# Altium project Quail_3.1.PrjPcb (part 3 of 3)

## Sheet LoadCell.SchDoc
size A
Used 2 times, as channels AFE/LC1, AFE/LC2. Parts and nets are listed once, with the designators drawn on the sheet.
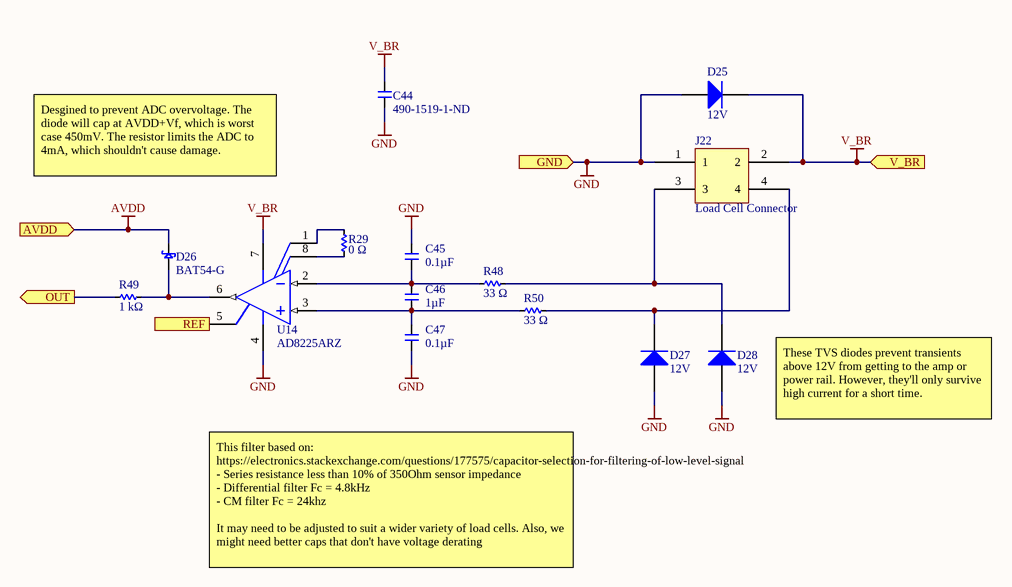
[diagram p9: LoadCell.SchDoc]

### Parts
C44  490-1519-1-ND  [C0603]
C45  Capacitance: 0.1µF  [C0603]  (hidden comment: CAP_CER_100NF_100V)
C46  Capacitance (shorthand): 1µF  [C0603]  (hidden comment: 490-3900-1-ND)
C47  Capacitance: 0.1µF  [C0603]  (hidden comment: CAP_CER_100NF_100V)
D25  Reverse Standoff Voltage: 12V  [VISH-DO-214AC-2_M]  (hidden comment: SMAJ12A-E3/61)
D26  Manufacturer Part Number: BAT54-G  [3SOT23]  (hidden comment: SCHOTTKY_BAT54-G)
D27  Reverse Standoff Voltage: 12V  [VISH-DO-214AC-2_M]  (hidden comment: SMAJ12A-E3/61)
D28  Reverse Standoff Voltage: 12V  [VISH-DO-214AC-2_M]  (hidden comment: SMAJ12A-E3/61)
J22  Load Cell Connector  [MOLEX_2x2_0430450400]
R29  Resistance: 0 Ω  [R0603]  (hidden comment: 311-0.0HRCT-ND)
R48  Resistance: 33 Ω  [R0603]  (hidden comment: 311-33.0HRCT-ND)
R49  Resistance: 1 kΩ  [R0603]  (hidden comment: 311-1.00KHRCT-ND)
R50  Resistance: 33 Ω  [R0603]  (hidden comment: 311-33.0HRCT-ND)
U14  AD8225ARZ  [ADI-R-8_N]

### Ports
AVDD (in), GND (in), OUT (out), REF (in), V_BR (in)

### Nets
AVDD: D26.3 ; port AVDD
GND: C44.2 C45.1 C47.2 D25.2(A) D27.2(A) D28.2(A) J22.1 U14.4(VS-) ; port GND
V_BR: C44.1 D25.1(K) J22.2 U14.7(VS+) ; port V_BR
OUT: R49.1 ; port OUT
REF: U14.5(REF) ; port REF
NetC45_2: C45.2 C46.1 R48.1 U14.2(IN-)
NetC46_2: C46.2 C47.1 R50.1 U14.3(IN+)
NetD26_1: D26.1 R49.2 U14.6(VOUT)
NetD27_1: D27.1(K) J22.4 R50.2
NetD28_1: D28.1(K) J22.3 R48.2
NetR29_1: R29.1 U14.8(NC)
NetR29_2: R29.2 U14.1(NC)

### Channels
AFE/LC1: designators end in A; ports AVDD=AVDD GND=AGND OUT=AIN12 REF=REF-1V65 V_BR=VBR
AFE/LC2: designators end in B; ports AVDD=AVDD GND=AGND OUT=AIN13 REF=REF-1V65 V_BR=VBR

### Notes on the sheet
- Desgined to prevent ADC overvoltage. The diode will cap at AVDD+Vf, which is worst case 450mV. The resistor limits the ADC to 4mA, which shouldn't cause damage.
- These TVS diodes prevent transients above 12V from getting to the amp or power rail. However, they'll only survive high current for a short time.
- This filter based on:
  https://electronics.stackexchange.com/questions/177575/capacitor-selection-for-filtering-of-low-level-signal
  - Series resistance less than 10% of 350Ohm sensor impedance
  - Differential filter Fc = 4.8kHz
  - CM filter Fc = 24khz
  It may need to be adjusted to suit a wider variety of load cells. Also, we might need better caps that don't have voltage derating

### Library data of the parts
C44 = CMP-119-0065-1: CAP CER 0603 0.1µF X7R 50V 10%; Manufacturer: Murata Electronics North America; Capacitance - pF (Machine readable): #NAME?; Capacitance (shorthand): 0.1µF; Rated Voltage: 50V; Dielectric: X7R
C45 C47 = CMP-027-0018-1: CAP CER 0.1UF 100V X7S 0603; Manufacturer: TDK Corporation; Manufacturer Part Number: C1608X7S2A104K080AB; Tolerance: ±10%; Failure Rate: -; Mounting Type: Surface Mount, MLCC; Pricing 1: 1=0.19, 10=0.133, 100=0.0673, 500=0.04604, 1000=0.04073 (USD); RoHS: RoHS Compliant; ComponentLink1Description: https://product.tdk.com/info/en/catalog/datasheets/mlcc_commercial_midvoltage_en.pdf; Features: -; Design Item ID: CAP_CER_100NF_100V; Lead Spacing: -; Source: capacitor.SchLib; Packaging: Cut Tape (CT); Lead Style: -; Ratings: -; Part Status: Active; Temperature Coefficient: X7S; Operating Temperature: -55°C ~ 125°C; ComponentLink1URL: https://product.tdk.com/info/en/catalog/datasheets/mlcc_commercial_midvoltage_en.pdf; Stock 1: 662530; Size / Dimension: 0.063" L x 0.031" W (1.60mm x 0.80mm); Voltage - Rated: 100V; Applications: General Purpose; Package / Case: 0603 (1608 Metric); Thickness (Max): 0.037" (0.95mm); Height - Seated (Max): -
C46 = CMP-119-0068-1: CAP CER 0603 1µF X7R 16V 10%; Manufacturer: Murata Electronics North America; Capacitance - pF (Machine readable): #NAME?; Rated Voltage: 16V; Dielectric: X7R
D25 D27 D28 = CMP-00008-1: VISHAY - SMAJ12A-E3/61 - TVS-diod, TVS, SMAJ1 Serien, Enkelriktad, 12 V, 19.9 V, DO-214AC (SMA), 2 Stift; Current: 201A; Test Current: 1mA; Clamping Voltage: 19.9V; Min Breakdown Voltage: 13.3V; Direction: Unidirectional; Peak Pulse Power: 400W; Max Breakdown Voltage: 14.7V; Peak Pulse Current: 20.1A; Number of Channels: 1; Leakage Current: 1uA; Max Forward Surge Current (Ifsm): 40A; Element Configuration: Single; Number of Pins: 2; Min Operating Temperature: -55°C; Case/Package: SMA; Packaging: Tape and Reel; Radiation Hardening: No; Voltage Rating (DC): 12V; Height: 2.09mm; REACH SVHC: Unknown; Clamping Voltage-Max: 19.9V; Max Power Dissipation: 400W; Length: 4.5mm; Package Quantity: 1800; Operating Supply Voltage: 12V; Reverse Breakdown Voltage: 13.3V; Number of Elements: 1; Series: SMAJ; Lead Free: Lead Free; Termination: SMD/SMT; Voltage: 12V; Contact Plating: Tin,Matte; Width: 2.79mm; Power Dissipation: 400W; Polarity: Unidirectional; Max Reverse Leakage Current: 1uA; Max Surge Current: 20.1A; Max Operating Temperature: 150°C; Breakdown Voltage: 13.3V
D26 = CMP-033-0032-1: DIODE SCHOTTKY 200MA 30V SOT-23; Manufacturer: Comchip Technology; Capacitance @ Vr, F: 10pF @ 1V, 1MHz; Reverse Recovery Time (trr): 5ns; Current - Reverse Leakage @ Vr: 2mA @ 25V; Speed: Small Signal =< 200mA (Io), Any Speed; Voltage - Forward (Vf) (Max) @ If: 1V @ 100mA; Voltage - DC Reverse (Vr) (Max): 30V; Current - Average Rectified (Io): 200mA; Mounting Type: Surface Mount; ComponentLink1URL: http://comchipt.ipower.com/docs/BAT54.pdf; Diode Type: Schottky; Supplier Device Package: SOT-23-3; Stock 1: 5641; Source: diode.SchLib; Pricing 1: 1=0.35, 10=0.24, 100=0.112, 250=0.08, 500=0.0544, 1000=0.0432 (USD); RoHS: RoHS Compliant; Package / Case: TO-236-3, SC-59, SOT-23-3; ComponentLink1Description: Datasheet; Packaging: Cut Tape (CT); Design Item ID: SCHOTTKY_BAT54-G
J22 = CMP-030-0039-1: MICROFIT CONN HEADER R/A 4POS 3MM; Design Item ID: MOLEX_2x2_0430450400; Source: connector.SchLib
R29 = CMP-126-0000-2: RES SMD 0 OHM JUMPER 1/10W 0603; Manufacturer: Yageo; Manufacturer Part Number: RC0603FR-070RL; Power (Watts): 0.1W, 1/10W; Resistance (Sortable): 0; Temperature Coefficient: -; Datasheets: http://www.yageo.com/documents/recent/PYu-RC_Group_51_RoHS_L_9.pdf; Tolerance: Jumper; Image: //media.digikey.com/Renders/Yageo%20Renders/0603-(1608-Metric).jpg; Operating Temperature: -55°C ~ 155°C; Supplier 1: Mouser; Supplier Part Number 1: 667-ERJ-PB3B2492V
R48 R50 = CMP-126-0025-2: RES SMD 33 OHM 1% 1/10W 0603; Manufacturer Part Number: RC0603FR-0733RL; Manufacturer: Yageo; Power (Watts): 0.1W, 1/10W; Temperature Coefficient: ±100ppm/°C; Resistance (Sortable): 33; Tolerance: ±1%; Operating Temperature: -55°C ~ 155°C; Datasheets: http://www.yageo.com/documents/recent/PYu-RC_Group_51_RoHS_L_9.pdf; Image: //media.digikey.com/Renders/Yageo%20Renders/0603-(1608-Metric).jpg
R49 = CMP-126-0172-2: RES SMD 1K OHM 1% 1/10W 0603; Manufacturer Part Number: RC0603FR-071KL; Manufacturer: Yageo; Power (Watts): 0.1W, 1/10W; Temperature Coefficient: ±100ppm/°C; Resistance (Sortable): 1000; Tolerance: ±1%; Operating Temperature: -55°C ~ 155°C; Datasheets: http://www.yageo.com/documents/recent/PYu-RC_Group_51_RoHS_L_9.pdf; Image: //media.digikey.com/Renders/Yageo%20Renders/0603-(1608-Metric).jpg
U14 = CMP-00004-1: SP Amp INSTR Amp Single ±18V/36V 8-Pin SOIC N Tube; Max Power Dissipation: 650mW; Number of Elements: 1; Max Dual Supply Voltage: 18V; Input Offset Voltage (Vos): 50uV; Min Dual Supply Voltage: 1.7V; Common Mode Rejection Ratio: 86dB; Min Supply Voltage: 3.4V; Output Current per Channel: 18mA; Bandwidth: 900kHz; Nominal Supply Current: 1.05mA; Power Supply Rejection Ratio (PSRR): 90dB; Voltage Gain: 13.98dB; Max Supply Voltage: 36V; Operating Supply Current: 1.2mA; Slew Rate: 5V/µs; Input Bias Current: 1.2nA; Input Resistance: 10GR; Length: 5mm; Radiation Hardening: No; Number of Amplifiers: 1; Package Quantity: 98; Power Dissipation: 650mW; Lead Free: Contains Lead; Number of Circuits: 1; Min Operating Temperature: -40°C; Number of Pins: 8; Quiescent Current: 1.05mA; Contact Plating: Tin,Matte; -3db Bandwidth: 900kHz; REACH SVHC: No SVHC; Width: 4mm; Height: 1.5mm; Max Operating Temperature: 85°C; Packaging: Rail/Tube; Number of Channels: 1; Case/Package: SOIC; Max Supply Current: 1.2mA

## Sheet PressureTransducer.SchDoc
size A
Used 4 times, as channels AFE/PT1, AFE/PT2, AFE/PT3, AFE/PT4. Parts and nets are listed once, with the designators drawn on the sheet.
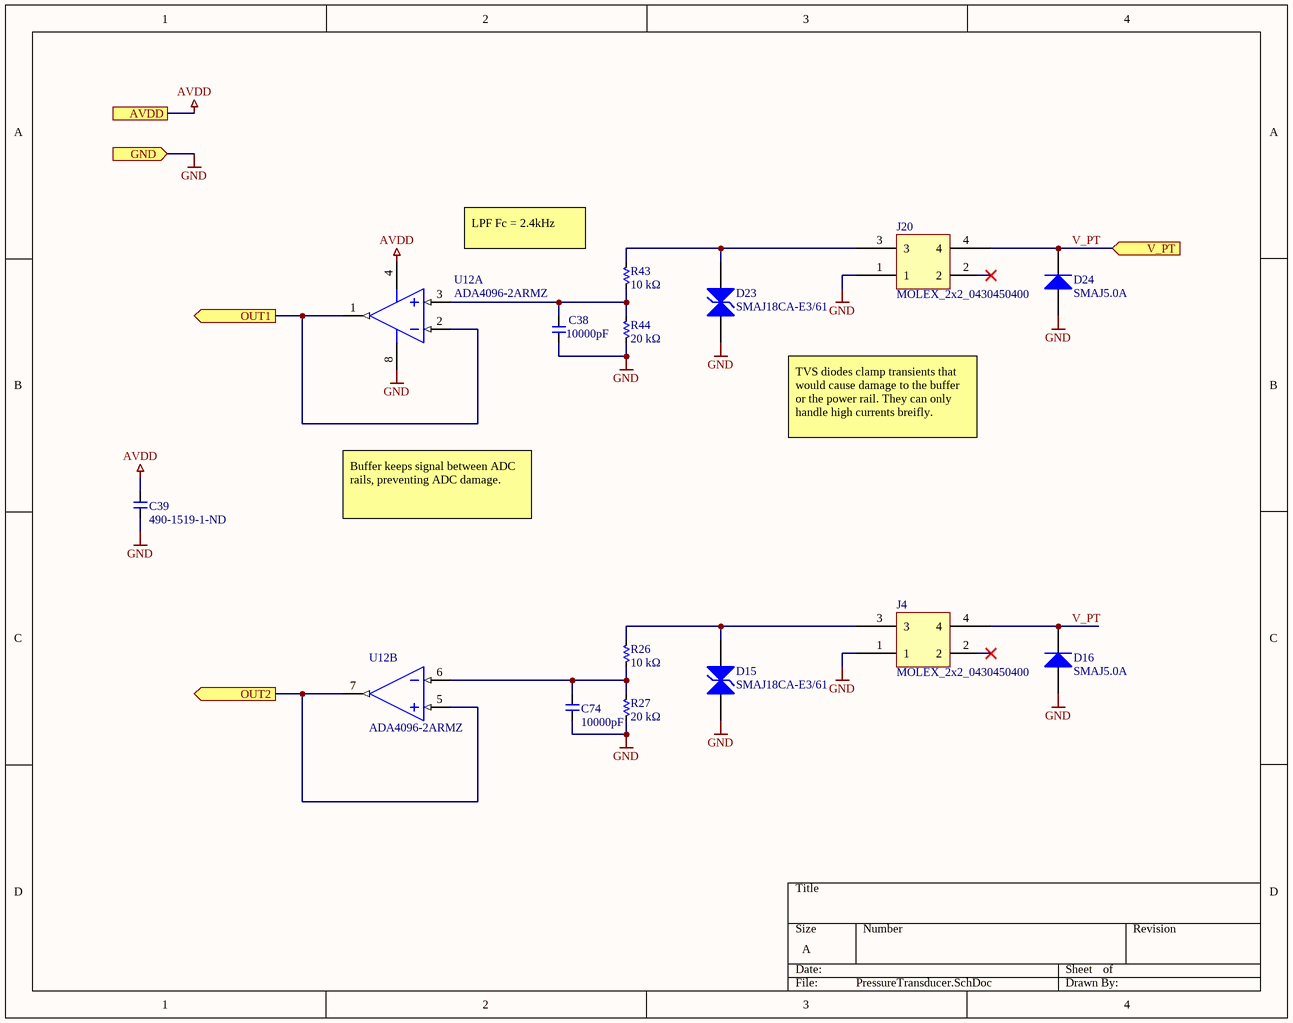
[diagram p10: PressureTransducer.SchDoc]

### Parts
C38  Capacitance (shorthand): 10000pF  [C0603]  (hidden comment: 490-1512-1-ND)
C39  490-1519-1-ND  [C0603]
C74  Capacitance (shorthand): 10000pF  [C0603]  (hidden comment: 490-1512-1-ND)
D15  SMAJ18CA-E3/61  [VISH-DO-214AC-2_M]
D16  SMAJ5.0A  [BOUR-SMA-2_V]
D23  SMAJ18CA-E3/61  [VISH-DO-214AC-2_M]
D24  SMAJ5.0A  [BOUR-SMA-2_V]
J4  MOLEX_2x2_0430450400  [MOLEX_2x2_0430450400]
J20  MOLEX_2x2_0430450400  [MOLEX_2x2_0430450400]
R26  Resistance: 10 kΩ  [R0603]  (hidden comment: 311-10.0KHRCT-ND)
R27  Resistance: 20 kΩ  [R0603]  (hidden comment: 311-20.0KHRCT-ND)
R43  Resistance: 10 kΩ  [R0603]  (hidden comment: 311-10.0KHRCT-ND)
R44  Resistance: 20 kΩ  [R0603]  (hidden comment: 311-20.0KHRCT-ND)
U12  ADA4096-2ARMZ  [ADI-RM-8_M]  (parts A,B of 2)

### Ports
AVDD, GND (in), OUT1 (out), OUT2 (out), V_PT (in)

### Nets
AVDD: C39.1 U12.4(-V) ; port AVDD
GND: C38.2 C39.2 C74.2 D15.1(A1) D16.1(A) D23.1(A1) D24.1(A) J4.1 J20.1 R27.1 R44.1 U12.8(+V) ; port GND
OUT1: U12.1(OUT_A) U12.2(-IN_A) ; port OUT1
OUT2: U12.5(+IN_B) U12.7(OUT_B) ; port OUT2
V_PT: D16.2(K) D24.2(K) J4.4 J20.4 ; port V_PT
NetC38_1: C38.1 R43.1 R44.2 U12.3(+IN_A)
NetC74_1: C74.1 R26.1 R27.2 U12.6(-IN_B)
NetD15_2: D15.2(A2) J4.3 R26.2
NetD23_2: D23.2(A2) J20.3 R43.2

Not connected (* = marked no-connect by the designer): J4 2*; J20 2*

### Channels
AFE/PT1: designators end in A; ports AVDD=AVDD GND=AGND OUT1=AIN1 OUT2=AIN2 V_PT=V_PT
AFE/PT2: designators end in B; ports AVDD=AVDD GND=AGND OUT1=AIN3 OUT2=AIN4 V_PT=V_PT
AFE/PT3: designators end in C; ports AVDD=AVDD GND=AGND OUT1=AIN5 OUT2=AIN6 V_PT=V_PT
AFE/PT4: designators end in D; ports AVDD=AVDD GND=AGND OUT1=AIN7 OUT2=AIN8 V_PT=V_PT

### Notes on the sheet
- LPF Fc = 2.4kHz
- TVS diodes clamp transients that would cause damage to the buffer or the power rail. They can only handle high currents breifly.
- Buffer keeps signal between ADC rails, preventing ADC damage.

### Library data of the parts
C38 C74 = CMP-119-0053-1: CAP CER 0603 10000pF X7R 50V 10%; Manufacturer: Murata Electronics North America; Capacitance - pF (Machine readable): #NAME?; Dielectric: X7R; Rated Voltage: 50V
C39 = CMP-119-0065-1: as C44 on sheet LoadCell; Capacitance (shorthand): 0.1µF; Dielectric: X7R; Rated Voltage: 50V
D15 D23 = CMP-00018-1: Diode TVS Single Bi-Dir 18V 400W 2-Pin SMA T/R; Number of Channels: 1; Max Breakdown Voltage: 22.1V; Direction: Bidirectional; Max Reverse Leakage Current: 1uA; Clamping Voltage: 29.2V; Max Surge Current: 13.7A; Max Forward Surge Current (Ifsm): 40A; Test Current: 1mA; Min Breakdown Voltage: 20V; Power Dissipation: 400W; Lead Free: Lead Free; Max Operating Temperature: 150°C; Weight: 0.064g; Min Operating Temperature: -55°C; Operating Supply Voltage: 18V; Case/Package: DO-214AC; Polarity: Bidirectional; Termination: SMD/SMT; Height: 0.09inch; Width: 0.11inch; Series: SMAJ; Reverse Standoff Voltage: 18V; Clamping Voltage-Max: 29.2V; Max Power Dissipation: 400W; Package Quantity: 1800; Voltage Rating (DC): 18V; REACH SVHC: Unknown; Packaging: Tape and Reel; Radiation Hardening: No; Peak Pulse Current: 13.7A; Length: 0.177inch; Element Configuration: Single; Number of Elements: 1; Leakage Current: 1uA; Peak Pulse Power: 400W; Number of Pins: 2; Reverse Breakdown Voltage: 20V; Contact Plating: Tin,Matte; Breakdown Voltage: 20V
D16 D24 = CMP-00017-1: BOURNS - SMAJ5.0A - TVS Diode, SMAJ Series, Unidirectional, 5 V, 9.2 V, DO-214AC (SMA), 2 Pins; Min Breakdown Voltage: 6.4V; ESD Protection: Yes; Test Current: 10mA; Clamping Voltage: 9.2V; Leakage Current: 800uA; Max Breakdown Voltage: 7V; Number of Unidirectional Channels: 1; Operating Supply Voltage: 3.5V; Peak Pulse Current: 43.5A; Power Line Protection: No; Peak Pulse Power: 400W; Reverse Standoff Voltage: 5V; Diode Type: ZENER; Element Configuration: Single; Max Surge Current: 40A; Height: 2.42mm; Case/Package: DO-214AC; Max Reverse Leakage Current: 800uA; Packaging: Tape and Reel; REACH SVHC: No SVHC; Direction: Unidirectional; Series: SMAJ; Radiation Hardening: No; Mount: Surface Mount; Max Operating Temperature: 150°C; Package Quantity: 1; Width: 2.92mm; Reverse Breakdown Voltage: 6.4V; Number of Channels: 1; Polarity: Unidirectional; Min Operating Temperature: -55°C; Length: 4.57mm; Resistor Type: Zener; Max Power Dissipation: 400W; Number of Pins: 2; Breakdown Voltage: 7V; Number of Elements: 1; Termination: SMD/SMT
J4 J20 = CMP-030-0039-1: MICROFIT CONN HEADER R/A 4POS 3MM; Design Item ID: MOLEX_2x2_0430450400; Source: connector.SchLib
R26 R43 = CMP-126-0273-2: RES SMD 10K OHM 1% 1/10W 0603; Manufacturer Part Number: RC0603FR-0710KL; Manufacturer: Yageo; Resistance (Sortable): 10000; Power (Watts): 0.1W, 1/10W; Temperature Coefficient: ±100ppm/°C; Datasheets: http://www.yageo.com/documents/recent/PYu-RC_Group_51_RoHS_L_9.pdf; Image: //media.digikey.com/Renders/Yageo%20Renders/0603-(1608-Metric).jpg; Tolerance: ±1%; Operating Temperature: -55°C ~ 155°C
R27 R44 = CMP-126-0304-2: RES SMD 20K OHM 1% 1/10W 0603; Manufacturer Part Number: RC0603FR-0720KL; Manufacturer: Yageo; Resistance (Sortable): 20000; Power (Watts): 0.1W, 1/10W; Temperature Coefficient: ±100ppm/°C; Datasheets: http://www.yageo.com/documents/recent/PYu-RC_Group_51_RoHS_L_9.pdf; Image: //media.digikey.com/Renders/Yageo%20Renders/0603-(1608-Metric).jpg; Tolerance: ±1%; Operating Temperature: -55°C ~ 155°C
U12 = CMP-00007-2: Operational Amplifier, Dual, 501 kHz, 2, 0.25 V/ s, 3V to 30V, MSOP, 8 ;RoHS Compliant: Yes; Number of Circuits: 2; Common Mode Rejection Ratio: 77dB; Bandwidth: 501kHz; Amplifier Type: GENERAL PURPOSE; Max Dual Supply Voltage: 15V; Input Capacitance: 7pF; Operating Supply Current: 120uA; -3db Bandwidth: 152kHz; Power Supply Rejection Ratio (PSRR): 100dB; Quiescent Current: 60uA; Gain Bandwidth Product: 786kHz; Unity Gain Bandwidth Product: 550kHz; Input Bias Current: 10nA; Voltage Gain: 111dB; Input Voltage Noise Density: 27nV/sqrt Hz; Min Dual Supply Voltage: 1.5V; Input Offset Voltage (Vos): 300uV; Slew Rate: 0.25V/µs; Output Current per Channel: 10mA; Number of Channels: 2; Case/Package: MSOP; Min Supply Voltage: 3V; Number of Amplifiers: 2; Width: 3.2mm; Packaging: Rail/Tube; Length: 3.2mm; Series: -; Max Operating Temperature: 125°C; Technology: BIPOLAR; REACH SVHC: No SVHC; Height: 0.95mm; Max Supply Voltage: 30V; Number of Pins: 8; Contact Plating: Tin,Matte; Radiation Hardening: No; Package Quantity: 50; Number of Elements: 2; Lead Free: Contains Lead; Min Operating Temperature: -40°C

## Sheet Thermocouple.SchDoc
size A
Used 3 times, as channels AFE/TC1, AFE/TC2, AFE/TC3. Parts and nets are listed once, with the designators drawn on the sheet.
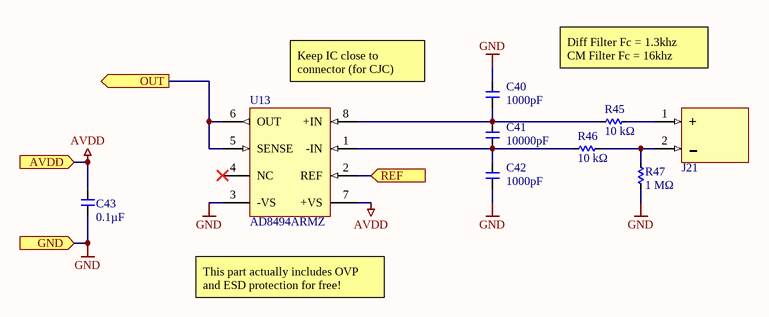
[diagram p11: Thermocouple.SchDoc]

### Parts
C40  Capacitance (shorthand): 1000pF  [C0603]  (hidden comment: 490-1494-1-ND)
C41  Capacitance (shorthand): 10000pF  [C0603]  (hidden comment: 490-1512-1-ND)
C42  Capacitance (shorthand): 1000pF  [C0603]  (hidden comment: 490-1494-1-ND)
C43  Capacitance (shorthand): 0.1µF  [C0603]  (hidden comment: 490-1519-1-ND)
J21  PCC-SMP-V-K  [PCC-SMP-V-K-Footprint-1]  (value not drawn)
R45  Resistance: 10 kΩ  [R0603]  (hidden comment: 311-10.0KHRCT-ND)
R46  Resistance: 10 kΩ  [R0603]  (hidden comment: 311-10.0KHRCT-ND)
R47  Resistance: 1 MΩ  [R0603]  (hidden comment: 311-1.00MHRCT-ND)
U13  AD8494ARMZ  [ADI-RM-8_N]

### Ports
AVDD (in), GND (in), OUT (out), REF (in)

### Nets
AVDD: C43.1 U13.7(+VS) ; port AVDD
GND: C40.1 C42.2 C43.2 R47.1 U13.3(-VS) ; port GND
OUT: U13.5(SENSE) U13.6(OUT) ; port OUT
REF: U13.2(REF) ; port REF
NetC40_2: C40.2 C41.1 R45.1 U13.8(+IN)
NetC41_2: C41.2 C42.1 R46.1 U13.1(-IN)
NetJ21_1: J21.1(+) R45.2
NetJ21_2: J21.2(-) R46.2 R47.2

Not connected (* = marked no-connect by the designer): U13 4(NC)*

### Channels
AFE/TC1: designators end in A; ports AVDD=AVDD GND=AGND OUT=NetR58_1 REF=REF-1V65
AFE/TC2: designators end in B; ports AVDD=AVDD GND=AGND OUT=NetR61_1 REF=REF-1V65
AFE/TC3: designators end in C; ports AVDD=AVDD GND=AGND OUT=NetR64_1 REF=REF-1V65

### Notes on the sheet
- (near U13) Keep IC close to connector (for CJC)
- Diff Filter Fc = 1.3khz
  CM Filter Fc = 16khz
- This part actually includes OVP and ESD protection for free!

### Library data of the parts
C40 C42 = CMP-119-0040-1: CAP CER 0603 1000pF X7R 50V 10%; Manufacturer: Murata Electronics North America; Capacitance - pF (Machine readable): #NAME?; Dielectric: X7R; Rated Voltage: 50V
C41 = CMP-119-0053-1: as C38 on sheet PressureTransducer; Rated Voltage: 50V; Dielectric: X7R
C43 = CMP-119-0065-1: as C44 on sheet LoadCell; Dielectric: X7R; Rated Voltage: 50V
J21 = CMP-00005-1: THERMOCOUPLE CONN, K TYPE, RCPT; Gender: Receptacle; Thermocouple Type: K; Product Range: PCC SMP Series; Junction Type: K
R45 R46 = CMP-126-0273-2: RES SMD 10K OHM 1% 1/10W 0603; Manufacturer Part Number: RC0603FR-0710KL; Manufacturer: Yageo; Power (Watts): 0.1W, 1/10W; Temperature Coefficient: ±100ppm/°C; Resistance (Sortable): 10000; Tolerance: ±1%; Operating Temperature: -55°C ~ 155°C; Datasheets: http://www.yageo.com/documents/recent/PYu-RC_Group_51_RoHS_L_9.pdf; Image: //media.digikey.com/Renders/Yageo%20Renders/0603-(1608-Metric).jpg
R47 = CMP-126-0484-2: RES SMD 1M OHM 1% 1/10W 0603; Manufacturer Part Number: RC0603FR-071ML; Manufacturer: Yageo; Power (Watts): 0.1W, 1/10W; Resistance (Sortable): 1000000; Temperature Coefficient: ±100ppm/°C; Operating Temperature: -55°C ~ 155°C; Image: //media.digikey.com/Renders/Yageo%20Renders/0603-(1608-Metric).jpg; Datasheets: http://www.yageo.com/documents/recent/PYu-RC_Group_51_RoHS_L_9.pdf; Tolerance: ±1%
U13 = CMP-00003-2: IC THRMOCPLE COLD JNC COMP 8MSOP; Nominal Supply Current: 180uA; Max Supply Current: 250uA; Output Type: Analog; Gain Bandwidth Product: 30kHz; Max Supply Voltage: 18V; Min Supply Voltage: 2.7V; Length: 3.2mm; Height: 0.95mm; Contact Plating: Tin,Matte; Package Quantity: 50; REACH SVHC: No SVHC; Operating Supply Current: 180uA; Max Operating Temperature: 125°C; Case/Package: MSOP; Min Operating Temperature: -40°C; Packaging: Rail/Tube; Number of Pins: 8; Lead Free: Contains Lead; Dual Supply Voltage: 18V; Width: 3.2mm

## Sheet Ethernet.SchDoc
size A3
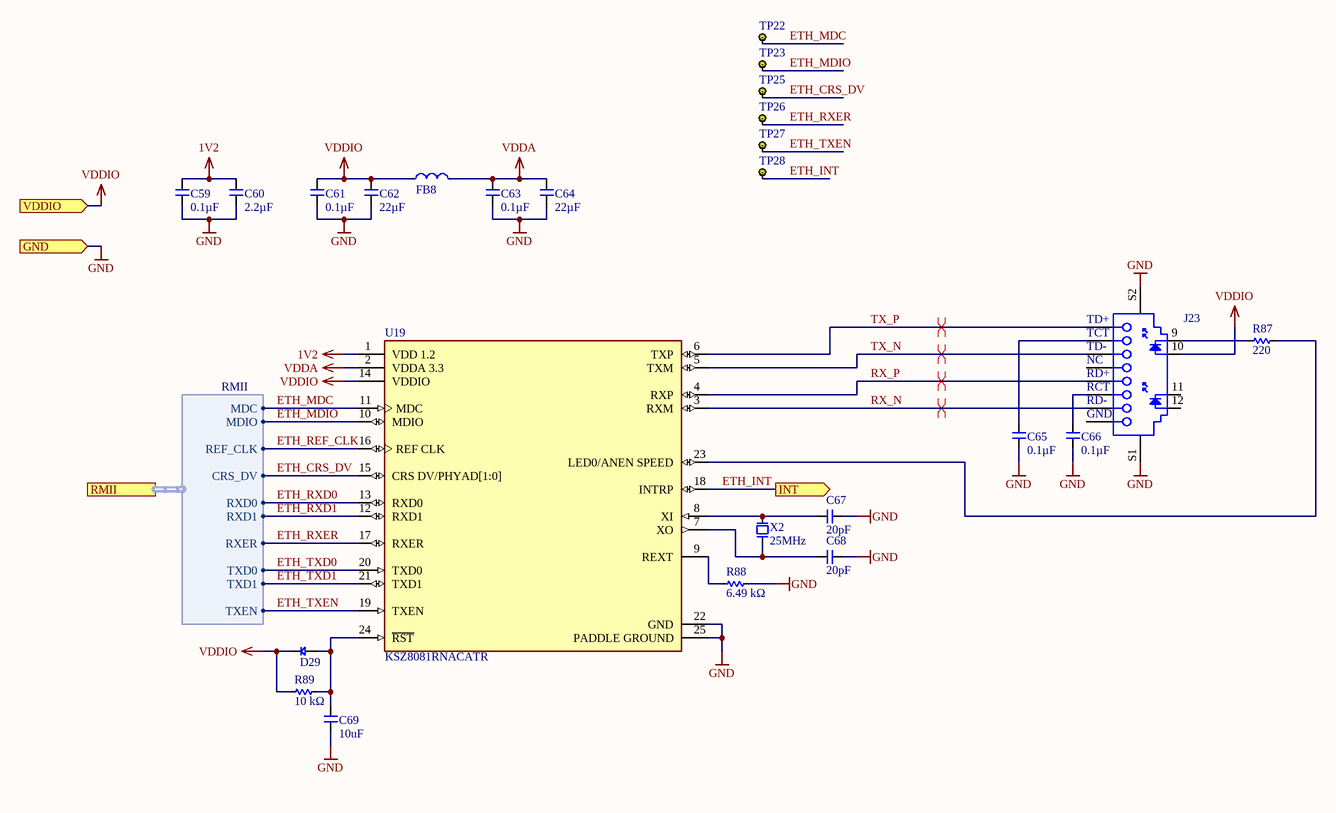
[diagram p12: Ethernet.SchDoc]

### Parts
C59  Capacitance (shorthand): 0.1µF  [C0603]  (hidden comment: 490-1519-1-ND)
C60  Capacitance (shorthand): 2.2µF  [C0603]  (hidden comment: 490-10731-1-ND)
C61  Capacitance (shorthand): 0.1µF  [C0603]  (hidden comment: 490-1519-1-ND)
C62  Capacitance (shorthand): 22µF  [C0603]  (hidden comment: 1276-7076-1-ND)
C63  Capacitance (shorthand): 0.1µF  [C0603]  (hidden comment: 490-1519-1-ND)
C64  Capacitance (shorthand): 22µF  [C0603]  (hidden comment: 1276-7076-1-ND)
C65  Capacitance (shorthand): 0.1µF  [C0603]  (hidden comment: 490-1519-1-ND)
C66  Capacitance (shorthand): 0.1µF  [C0603]  (hidden comment: 490-1519-1-ND)
C67  Capacitance (shorthand): 20pF  [C0603]  (hidden comment: 490-1410-1-ND)
C68  Capacitance (shorthand): 20pF  [C0603]  (hidden comment: 490-1410-1-ND)
C69  Capacitance: 10uF  [C0603]  (hidden comment: CAP_CER_10UF_6.3V_20%_X5R_SMD)
D29  DIODE_1N4148WT  [SOD523]  (value not drawn)
FB8  FB_120@100MHz_0603  [C0603]  (value not drawn)
J23  SI-50170-F  [BELS-SI-50170-F_V]  (value not drawn)
R87  Resistance (Sortable): 220  [R0603]  (hidden comment: 311-220HRCT-ND)
R88  Resistance: 6.49 kΩ  [R0603]  (hidden comment: 311-6.49KHRCT-ND)
R89  Resistance: 10 kΩ  [R0603]  (hidden comment: 311-10.0KHRCT-ND)
TP22  TEST_POINT_BLACK_KEYSTONE_5001  [TEST_POINT_BLACK_KEYSTONE_5001-Footprint-1]  (value not drawn)
TP23  TEST_POINT_BLACK_KEYSTONE_5001  [TEST_POINT_BLACK_KEYSTONE_5001-Footprint-1]  (value not drawn)
TP25  TEST_POINT_BLACK_KEYSTONE_5001  [TEST_POINT_BLACK_KEYSTONE_5001-Footprint-1]  (value not drawn)
TP26  TEST_POINT_BLACK_KEYSTONE_5001  [TEST_POINT_BLACK_KEYSTONE_5001-Footprint-1]  (value not drawn)
TP27  TEST_POINT_BLACK_KEYSTONE_5001  [TEST_POINT_BLACK_KEYSTONE_5001-Footprint-1]  (value not drawn)
TP28  TEST_POINT_BLACK_KEYSTONE_5001  [TEST_POINT_BLACK_KEYSTONE_5001-Footprint-1]  (value not drawn)
U19  KSZ8081RNACATR  [FP-QFN44-24LD-PL-1-IPC_B]
X2  Frequency: 25MHz  [4_SMD_3.2X2.5MM]  (hidden comment: XTAL_ XC1817CT-ND)

### Ports
GND (in), INT (out), RMII (harness RMII), VDDIO (in)

### Harnesses
RMII: MDC, MDIO, REF_CLK, CRS_DV, RXD0, RXD1, RXER, TXD0, TXD1, TXEN

### Nets
1V2: C59.1 C60.1 U19.1(VDD_1.2)
GND: C59.2 C60.2 C61.2 C62.2 C63.2 C64.2 C65.2 C66.2 C67.2 C68.2 C69.1 J23.S1 J23.S2 R88.1 U19.22(GND) U19.25(PADDLE_GROUND) ; port GND  [project net DGND]
VDDA: C63.1 C64.1 FB8.2 U19.2(VDDA_3.3)
VDDIO: C61.1 C62.1 D29.2 FB8.1 J23.10 R89.1 U19.14(VDDIO) ; port VDDIO  [project net IOVDD]
ETH_CRS_DV: TP25.1 U19.15(CRS_DV/PHYAD[1:0]) ; port RMII.CRS_DV
ETH_INT: TP28.1 U19.18(INTRP) ; port INT
ETH_MDC: TP22.1 U19.11(MDC) ; port RMII.MDC
ETH_MDIO: TP23.1 U19.10(MDIO) ; port RMII.MDIO
ETH_REF_CLK: U19.16(REF_CLK) ; port RMII.REF_CLK
ETH_RXD0: U19.13(RXD0) ; port RMII.RXD0
ETH_RXD1: U19.12(RXD1) ; port RMII.RXD1
ETH_RXER: TP26.1 U19.17(RXER) ; port RMII.RXER
ETH_TXD0: U19.20(TXD0) ; port RMII.TXD0
ETH_TXD1: U19.21(TXD1) ; port RMII.TXD1
ETH_TXEN: TP27.1 U19.19(TXEN) ; port RMII.TXEN
RX_N: J23.7(RD-) U19.3(RXM)
RX_P: J23.5(RD+) U19.4(RXP)
TX_N: J23.3(TD-) U19.5(TXM)
TX_P: J23.1(TD+) U19.6(TXP)
NetC65_1: C65.1 J23.2(TCT)
NetC66_1: C66.1 J23.6(RCT)
NetC67_1: C67.1 U19.8(XI) X2.3
NetC68_1: C68.1 U19.7(XO) X2.1
NetC69_2: C69.2 D29.1 R89.2 U19.24(~{RST})
NetJ23_9: J23.9 R87.1
NetR87_2: R87.2 U19.23(LED0/ANEN_SPEED)
NetR88_2: R88.2 U19.9(REXT)

Not connected (* = marked no-connect by the designer): J23 4(NC) 8(GND) 11 12

### Layout directives
differential pair: RX_N, RX_P, TX_N, TX_P

### Library data of the parts
C59 C61 C63 C65 C66 = CMP-119-0065-1: as C44 on sheet LoadCell; Dielectric: X7R; Rated Voltage: 50V
C60 = CMP-119-0069-1: CAP CER 2.2UF 16V X5R 0603 10%; Manufacturer: Murata Electronics North America; Capacitance - pF (Machine readable): #NAME?; Rated Voltage: 25V; Dielectric: X5R
C62 C64 = CMP-119-0072-1: CAP CER 22UF 16V X5R 0603 20%; Manufacturer: Samsung Electro-Mechanics; Capacitance - pF (Machine readable): #NAME?; Rated Voltage: 16V; Dielectric: X5R
C67 C68 = CMP-119-0007-1: CAP CER 20PF 50V C0G/NP0 0603; Manufacturer: Murata Electronics North America; Dielectric: C0G, NP0; Capacitance - pF (Machine readable): 20; Rated Voltage: 50V
C69 = CMP-027-0052-1: CAP CER 10UF 6.3V X5R 0603; Manufacturer Part Number: JMK107BJ106MA-T; Manufacturer: Taiyo Yuden; Tolerance: 20%; Height: 0.8mm; Min Operating Temperature: -55°C; Dielectric: X5R; ComponentLink2URL: https://www.verical.com/server-webapp/html/getDatasheet?partID=638457; ComponentLink4URL: http://www.onlinecomponents.com/productFiles/mf-TAI/1611jmk107abj106ma-t.pdf; Mount: Surface Mount; Stock 1: 4000; ComponentLink1URL: https://www.yuden.co.jp/productdata/catalog/mlcc_all_e.pdf; Lead Free: Lead Free; ComponentLink2Description: https://www.verical.com/server-webapp/html/getDatasheet?partID=638457; Case Code (Metric): 1608; Design Item ID: CAP_CER_10UF_6.3V_20%_X5R_SMD; Number of Pins: 2; REACH SVHC: Unknown; Radiation Hardening: No; Case/Package: 0603; Termination: SMD/SMT; Pricing 1: 1=0.18, 10=0.126, 100=0.0594, 500=0.04168, 1000=0.0345 (USD); ComponentLink4Description: http://www.onlinecomponents.com/productFiles/mf-TAI/1611jmk107abj106ma-t.pdf; Voltage Rating (DC): 6.3V; Thickness: 0.035inch; Length: 1.6mm; Case Code (Imperial): 0603; Composition: Ceramic; ComponentLink3URL: http://www.farnell.com/datasheets/1497285.pdf; Width: 0.8mm; ComponentLink1Description: https://www.yuden.co.jp/productdata/catalog/mlcc_all_e.pdf; Depth: 0.8mm; ComponentLink3Description: http://www.farnell.com/datasheets/1497285.pdf; Max Operating Temperature: 85°C; Packaging: Tape and Reel; Package Quantity: 1; Source: capacitor.SchLib; Voltage Rating: 6.3V
D29 = CMP-033-0014-1: DIODE SW 75V 4NS SOD-523F; Manufacturer: Fairchild Semiconductor; Voltage - Forward (Vf) (Max) @ If: 1V @ 10mA; Capacitance @ Vr, F: 5pF @ 0V, 1MHz; Diode Type: Standard; Current - Reverse Leakage @ Vr: 5µA @ 75V; Current - Average Rectified (Io): 200mA; Speed: Small Signal =< 200mA (Io), Any Speed; Voltage - DC Reverse (Vr) (Max): 75V; ComponentLink1URL: http://www.fairchildsemi.com/ds/1N/1N914BWT.pdf; ComponentLink1Description: Datasheet; Pricing 1: 1=0.4, 10=0.26, 100=0.113, 250=0.07344, 500=0.05198, 1000=0.03673 (USD); Reverse Recovery Time (trr): 4ns; Source: diode.SchLib; Packaging: Cut Tape (CT); Supplier Device Package: SOD-523F; Stock 1: 71864; Mounting Type: Surface Mount; Manufacturer Part Number: 1N4148WT; Package / Case: SC-79, SOD-523F; Design Item ID: DIODE_1N4148WT; RoHS: RoHS Compliant
FB8 = CMP-051-0015-1: FERRITE BEAD 120 OHM @ 100 MHz; Manufacturer: Taiyo Yuden; Manufacturer Part Number: BKP1608HS121-T; Filter Type: Power Line; Number of Lines: 1; Current Rating (Max): 2.7A; DC Resistance (DCR) (Max): 35 mOhm; RoHS: RoHS Compliant; Stock 1: 47959; Pricing 1: 1=0.1, 10=0.059, 25=0.052, 50=0.0474, 100=0.0426, 250=0.0312, 500=0.0227, 1000=0.02223 (USD); Packaging: Cut Tape (CT); Part Status: Active; Ratings: -; Operating Temperature: -55°C ~ 85°C; Package / Case: 0603 (1608 Metric); Mounting Type: Surface Mount; Height (Max): 0.037" (0.95mm); Size / Dimension: 0.063" L x 0.031" W (1.60mm x 0.80mm); ComponentLink1URL: http://ds.yuden.co.jp/TYCOMPAS/ut/detail.do?productNo=BKP1608HS121-T&fileName=BKP1608HS121-T_SS&mode=specSheetDownload; ComponentLink1Description: http://ds.yuden.co.jp/TYCOMPAS/ut/detail.do?productNo=BKP1608HS121-T&fileName=BKP1608HS121-T_SS&mode=specSheetDownload; Impedance @ Frequency: 120 Ohm @ 100MHz; Design Item ID: FB_120@100MHz_0603; Source: inductor.SchLib
J23 = CMP-00015-1: CONN MAGJACK 1PORT 100 BASE-T; Connector Type: RJ45; Direction: Up; Pitch: 2.54mm; Number of Cores per Jack: 4; Shielding: Shielded; Number of Contacts: 8; Number of Positions Loaded: 7; Number of Ports: 1; Termination: Solder; Orientation: Right Angle; Length: 17.98mm; Number of Rows: 1; Depth: 25.4mm; Case/Package: Metal; Contact Plating: Gold; Mount: Through Hole; Packaging: Tray; Lead Free: Lead Free; Contact Material: Copper Alloy,Gold; Series: MagJack® ST SI-50000; Housing Material: Thermoplastic; Color: Green,Silver; Package Quantity: 50
R87 = CMP-126-0101-2: RES SMD 220 OHM 1% 1/10W 0603; Manufacturer Part Number: RC0603FR-07220RL; Manufacturer: Yageo; Resistance: 220 Ω; Power (Watts): 0.1W, 1/10W; Temperature Coefficient: ±100ppm/°C; Image: //media.digikey.com/Renders/Yageo%20Renders/0603-(1608-Metric).jpg; Operating Temperature: -55°C ~ 155°C; Datasheets: http://www.yageo.com/documents/recent/PYu-RC_Group_51_RoHS_L_9.pdf; Tolerance: ±1%
R88 = CMP-126-0255-2: RES SMD 6.49K OHM 1% 1/10W 0603; Manufacturer Part Number: RC0603FR-076K49L; Manufacturer: Yageo; Power (Watts): 0.1W, 1/10W; Resistance (Sortable): 6490; Temperature Coefficient: ±100ppm/°C; Tolerance: ±1%; Datasheets: http://www.yageo.com/documents/recent/PYu-RC_Group_51_RoHS_L_9.pdf; Operating Temperature: -55°C ~ 155°C; Image: //media.digikey.com/Renders/Yageo%20Renders/0603-(1608-Metric).jpg
R89 = CMP-126-0273-2: as R45 on sheet Thermocouple; Tolerance: ±1%; Operating Temperature: -55°C ~ 155°C; Datasheets: http://www.yageo.com/documents/recent/PYu-RC_Group_51_RoHS_L_9.pdf; Image: //media.digikey.com/Renders/Yageo%20Renders/0603-(1608-Metric).jpg
TP22 TP23 TP25-TP28 = CMP-055-0004-2: as TP12-TP21 on sheet AnalogFE; ComponentLink1Description: http://www.keyelco.com/product-pdf.cfm?p=1310; Source: mechanical.SchLib; Part Status: Active; Stock 1: 718799; RoHS: RoHS Compliant; Packaging: Bulk; Mounting Type: 0.040" (1.02mm) Hole Diameter; ComponentLink1URL: http://www.keyelco.com/product-pdf.cfm?p=1310; Pricing 1: 1=0.37, 10=0.316, 50=0.2298, 100=0.2209, 250=0.19832, 500=0.18932, 1000=0.1616, 2500=0.14424, 5000=0.13523 (USD); Size / Dimension: 0.100" Dia x 0.180" L (2.54mm x 4.57mm); Color: Black; Design Item ID: TEST_POINT_BLACK_KEYSTONE_5001
U19 = CMP-00009-1: Ethernet Controller, 100 Mbps, IEEE 802.3, 3.135 V, 3.465 V, QFN, 24 ;RoHS Compliant: Yes; Min Supply Voltage: 3.135V; Max Supply Voltage: 3.465V; Simplex/Duplex: Full Duplex; Operating Supply Voltage: 3.3V; Max Supply Current: 47mA; Number of Transceivers: 1; Length: 4mm; Number of Pins: 24; Package Quantity: 1000; REACH SVHC: Unknown; Radiation Hardening: No; Packaging: Tape and Reel; Case/Package: QFN; Lead Free: Lead Free; Max Operating Temperature: 70°C; Height: 0.83mm; Width: 4mm; Mount: Surface Mount; Min Operating Temperature: 0°C; Data Rate: 100Mbps; Number of Channels: 1; Supply Voltage-Nom: 3.3V; Series: -
X2 = CMP-066-0004-2: 25MHz ±10ppm Crystal 20pF 40 Ohm -20°C ~ 70°C Surface Mount 4-SMD, No Lead (DFN, LCC); Manufacturer Part Number: ECS-250-20-33-CKM-TR; Manufacturer: ECS Inc.; ESR (Equivalent Series Resistance): 40 Ohm; Operating Mode: Fundamental; Package / Case: 4-SMD, No Lead (DFN, LCC); Mounting Type: Surface Mount; Load Capacitance: 20pF; ComponentLink1URL: http://www.ecsxtal.com/store/pdf/ecx-32.pdf; Ratings: -; RoHS: RoHS Compliant; Packaging: Cut Tape (CT); Source: oscillator.SchLib; Operating Temperature: -20°C ~ 70°C; Size / Dimension: 0.126" L x 0.098" W (3.20mm x 2.50mm); Frequency Tolerance: ±10ppm; Design Item ID: XTAL_ XC1817CT-ND; Height: 0.031" (0.80mm); Stock 1: 5860; ComponentLink1Description: http://www.ecsxtal.com/store/pdf/ecx-32.pdf; Pricing 1: 1=1.04, 10=0.92, 50=0.8588, 100=0.76, 500=0.7182 (USD); Frequency Stability: ±10ppm

## Sheet GPS.SchDoc
size A
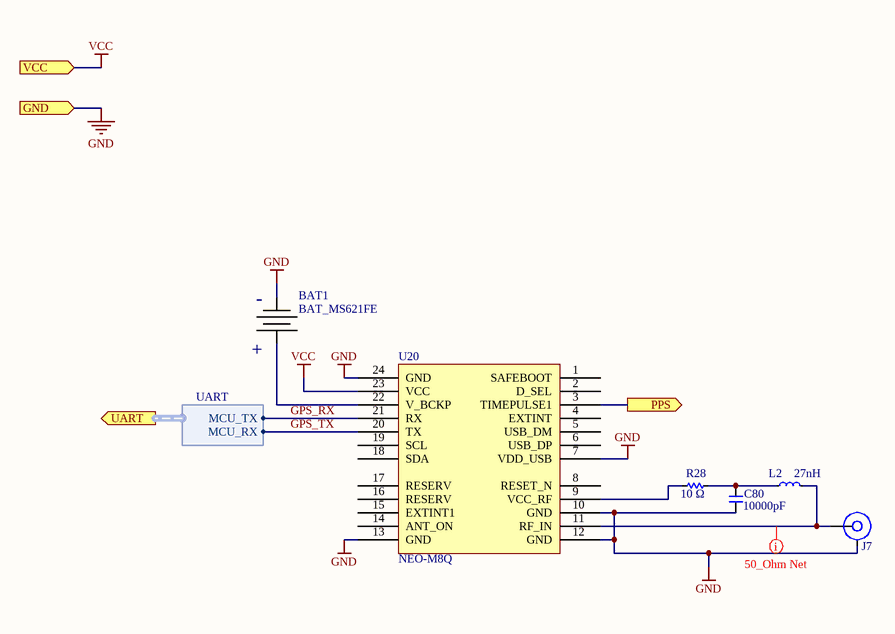
[diagram p13: GPS.SchDoc]

### Parts
BAT1  BAT_MS621FE  [BATT_COINCELL_RECHARGEABLE]
C80  Capacitance (shorthand): 10000pF  [C0603]  (hidden comment: 490-1512-1-ND)
J7  SMA_SAMTEC_TH_RA  [SMA_SAMTEC_SMA-J-P-X-RA-TH1]  (value not drawn)
L2  Inductance: 27nH  [R0402]  (hidden comment: 490-15373-1-ND)
R28  Resistance: 10 Ω  [R0603]  (hidden comment: 311-10.0HRCT-ND)
U20  NEO-M8Q  [NEO_M8]

### Ports
GND (in), PPS (out), UART (out, harness UART), VCC (in)

### Harnesses
UART: MCU_RX, MCU_TX

### Nets
GND: BAT1.- C80.1 J7.GND U20.7(VDD_USB) U20.10(GND) U20.12(GND) U20.13(GND) U20.24(GND) ; port GND  [project net DGND]
VCC: U20.23(VCC) ; port VCC  [project net IOVDD]
GPS_PPS: U20.3(TIMEPULSE1) ; port PPS
GPS_RX: U20.21(RX) ; port UART.MCU_TX
GPS_TX: U20.20(TX) ; port UART.MCU_RX
NetBAT1_+: BAT1.+ U20.22(V_BCKP)
NetC80_2: C80.2 L2.1 R28.2
NetJ7_SIG: J7.SIG L2.2 U20.11(RF_IN)
NetR28_1: R28.1 U20.9(VCC_RF)

Not connected (* = marked no-connect by the designer): U20 1(SAFEBOOT) 2(D_SEL) 4(EXTINT) 5(USB_DM) 6(USB_DP) 8(RESET_N) 14(ANT_ON) 15(EXTINT1) 16(RESERV) 17(RESERV) 18(SDA) 19(SCL)

### Layout directives
rule Clearance Constraint [Generic clearance = 0mil, and 21 value(s) for objects]: NetJ7_SIG

### Library data of the parts
BAT1 = CMP-060-0000-1: MS621FE RECHARGEABLE COIN CELL BACKUP; Manufacturer: Seiko Instruments; Manufacturer Part Number: MS621FE-FL11E; Battery Chemistry: Lithium; Battery Cell Size: Coin, 6.8mm; Capacity: 5.5mAh; Discharge Rate: 15µA; Shipping Info: Due to restrictions, only ground shipment is allowed.; RoHS: RoHS Compliant; Stock 1: 41059; Pricing 1: 1=2.04, 10=1.838, 50=1.6338, 100=1.4296, 250=1.30704, 500=1.22534, 1000=1.09051, 2500=1.0112, 5000=0.99138 (USD); Part Status: Active; Size / Dimension: 0.27" Dia x 0.08" H (6.8mm x 2.1mm); Termination Style: SMD (SMT) Tab; Standard Charge Current: 15µA; Standard Charge Time: -; Weight: 0.23g; ComponentLink1URL: http://www.sii.co.jp/en/me/files/2017/04/MicroBatteryCatalogue-E_2017_web.pdf; ComponentLink1Description: http://www.sii.co.jp/en/me/files/2017/04/MicroBatteryCatalogue-E_2017_web.pdf; Design Item ID: BAT_MS621FE; Source: miscellaneous.SchLib
C80 = CMP-119-0053-1: as C38 on sheet PressureTransducer; Rated Voltage: 50V; Dielectric: X7R
J7 = CMP-030-0020-1: Source: connector.SchLib; Design Item ID: SMA_SAMTEC_TH_RA
L2 = CMP-123-0062-1: FIXED IND 27NH 680MA 288 MOHM; Manufacturer: Murata Electronics North America; Frequency - Self Resonant: 4GHz; Inductance - nH (Machine readable): 27; Current Rating: 680mA
R28 = CMP-126-0002-2: RES SMD 10 OHM 1% 1/10W 0603; Manufacturer: Yageo; Manufacturer Part Number: RC0603FR-0710RL; Temperature Coefficient: ±200ppm/°C; Resistance (Sortable): 10; Power (Watts): 0.1W, 1/10W; Tolerance: ±1%; Operating Temperature: -55°C ~ 155°C; Image: //media.digikey.com/Renders/Yageo%20Renders/0603-(1608-Metric).jpg; Datasheets: http://www.yageo.com/documents/recent/PYu-RC_Group_51_RoHS_L_9.pdf
U20 = CMP-074-0003-2: Receiver GNSS 24LCC; Design Item ID: NEO_M8; Source: sensor.SchLib

## Sheet CAN.SchDoc
size A
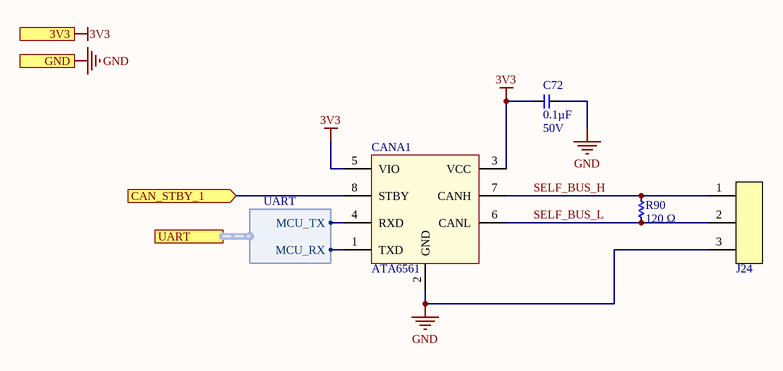
[diagram p14: CAN.SchDoc]

### Parts
C72  Capacitance (shorthand): 0.1µF  Rated Voltage: 50V  [C0603]  (hidden comment: 490-1519-1-ND)
CANA1  ATA6561  [8SOIC150]
J24  CONN_1x3  [CONN_1x3_100MIL]  (value not drawn)
R90  Resistance: 120 Ω  [R0603]  (hidden comment: 311-120HRCT-ND)

### Ports
3V3 (in), CAN_STBY_1 (in), GND (in), UART (harness UART)

### Harnesses
UART: MCU_RX, MCU_TX

### Nets
3V3: C72.2 CANA1.3(VCC) CANA1.5(VIO) ; port 3V3  [project net IOVDD]
GND: C72.1 CANA1.2(GND) J24.3 ; port GND  [project net DGND]
CAN_STBY_1: CANA1.8(STBY) ; port CAN_STBY_1
SELF_BUS_H: CANA1.7(CANH) J24.1 R90.2
SELF_BUS_L: CANA1.6(CANL) J24.2 R90.1
NetCANA1_1: CANA1.1(TXD) ; port UART.MCU_RX
NetCANA1_4: CANA1.4(RXD) ; port UART.MCU_TX

### Library data of the parts
C72 = CMP-119-0065-1: as C44 on sheet LoadCell; Dielectric: X7R
CANA1 = CMP-041-0000-1: Atmel CAN Bus Transciever; Design Item ID: ATA6561; Source: ic_data_converters.SchLib
J24 = CMP-029-0002-1: CONN HEADER 3POS T/H; Manufacturer Part Number: 61300311121; Manufacturer: Wurth Electronics; Gender: Male; Number of Contacts: 3; Connector Type: Male Pin; Pitch: 0.1inch; Pricing 1: 1=0.13, 10=0.106, 25=0.088, 50=0.074, 100=0.067, 1000=0.061 (USD); Design Item ID: CONN_1x3; REACH SVHC: Unknown; Mount: Through Hole; Color: Black; Contact Mating Length: 0.236inch; Number of Positions: 3; Termination: Solder; Source: connector.SchLib; Number of Rows: 1; Packaging: Bulk; Contact Plating: Gold; Lead Free: Lead Free; Stock 1: 146989; Contact Material: Copper
R90 = CMP-126-0077-2: RES SMD 120 OHM 1% 1/10W 0603; Manufacturer Part Number: RC0603FR-07120RL; Manufacturer: Yageo; Resistance (Sortable): 120; Power (Watts): 0.1W, 1/10W; Temperature Coefficient: ±100ppm/°C; Datasheets: http://www.yageo.com/documents/recent/PYu-RC_Group_51_RoHS_L_9.pdf; Image: //media.digikey.com/Renders/Yageo%20Renders/0603-(1608-Metric).jpg; Tolerance: ±1%; Operating Temperature: -55°C ~ 155°C

## Sheet Solenoid.SchDoc
size A
Used 12 times, as channels SOL1, SOL2, SOL3, SOL4, SOL5, SOL6, SOL7, SOL8, SOL9, SOL10, SOL11, SOL12. Parts and nets are listed once, with the designators drawn on the sheet.
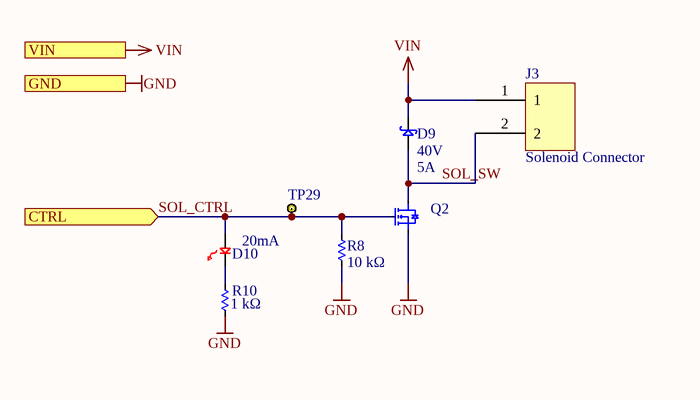
[diagram p15: Solenoid.SchDoc]

### Parts
D9  Voltage - DC Reverse (Vr) (Max): 40V  Current - Average Rectified (Io): 5A  [SMC]  (hidden comment: SCHOTTKY_B540C-13-F)
D10  Current - Test: 20mA  [0805_Diode]  (hidden comment: LED_LY974)
J3  Solenoid Connector  [Molex 172310-xx02]
Q2  NFET_CSD16323Q3  [8-VSON-THERMALS]  (value not drawn)
R8  Resistance: 10 kΩ  [R0603]  (hidden comment: 311-10.0KHRCT-ND)
R10  Resistance: 1 kΩ  [R0603]  (hidden comment: 311-1.00KHRCT-ND)
TP29  TEST_POINT_BLACK_KEYSTONE_5001  [TEST_POINT_KEYSTONE_5001]  (value not drawn)

### Ports
CTRL (in), GND (in), VIN (in)

### Nets
GND: Q2.3(S) R8.1 R10.1 ; port GND
VIN: D9.2 J3.1 ; port VIN
SOL_CTRL: D10.2 Q2.2(G) R8.2 TP29.1 ; port CTRL
SOL_SW: D9.1 J3.2 Q2.1(D)
NetD10_1: D10.1 R10.2

### Channels
SOL1: designators end in A; ports CTRL=SOL_CTRL GND=DGND VIN=12V0_SW
SOL2: designators end in B; ports CTRL=SOL_CTRL GND=DGND VIN=12V0_SW
SOL3: designators end in C; ports CTRL=SOL_CTRL GND=DGND VIN=12V0_SW
SOL4: designators end in D; ports CTRL=SOL_CTRL GND=DGND VIN=12V0_SW
SOL5: designators end in E; ports CTRL=SOL_CTRL GND=DGND VIN=12V0_SW
SOL6: designators end in F; ports CTRL=SOL_CTRL GND=DGND VIN=12V0_SW
SOL7: designators end in G; ports CTRL=SOL_CTRL GND=DGND VIN=12V0_SW
SOL8: designators end in H; ports CTRL=SOL_CTRL GND=DGND VIN=12V0_SW
SOL9: designators end in I; ports CTRL=SOL_CTRL GND=DGND VIN=12V0_SW
SOL10: designators end in J; ports CTRL=SOL_CTRL GND=DGND VIN=12V0_SW
SOL11: designators end in K; ports CTRL=SOL_CTRL GND=DGND VIN=12V0_SW
SOL12: designators end in L; ports CTRL=SOL_CTRL GND=DGND VIN=12V0_SW

### Library data of the parts
D9 = CMP-033-0054-1: DIODE SCHOTTKY 40V 5A SMC; Manufacturer: Diodes Inc; Voltage - Forward (Vf) (Max) @ If: 550mV @ 5A; Speed: Fast Recovery =< 500ns, > 200mA (Io); Current - Reverse Leakage @ Vr: 500µA @ 40V; Capacitance @ Vr, F: 300pF @ 4V, 1MHz; Rule: UNIONINDEX=0|RULEKIND=PolygonConnect|NETSCOPE=AnyNet|LAYERKIND=SameLayer|NAME=Schematic Polygon Connect Style|CONNECTSTYLE=Direct|RELIEFCONDUCTORWIDTH=10mil|RELIEFENTRIES=4|POLYGONRELIEFANGLE=45 Angle|AIRGAPWIDTH=10mil|UNIT=Imperial; RoHS: RoHS Compliant; Stock 1: 22018; Pricing 1: 1=1.06, 10=0.912, 100=0.72, 250=0.624, 500=0.528, 1000=0.42 (USD); Diode Type: Schottky; Reverse Recovery Time (trr): -; Mounting Type: Surface Mount; Package / Case: DO-214AB, SMC; Supplier Device Package: SMC; Packaging: Cut Tape (CT); Datasheet: http://www.diodes.com/datasheets/ds13012.pdf; Manufacturer Part Number: B540C-13-F; Design Item ID: SCHOTTKY_B540C-13-F; Source: diode.SchLib
D10 = CMP-033-0001-1: LED 0805 RED 20MA; Manufacturer: OSRAM Opto Semiconductors Inc; Manufacturer Part Number: LH R974-LP-1; Viewing Angle: 160°; Lens Transparency: Diffused; Millicandela Rating: 41mcd; Lens Style/Size: Rectangle with Flat Top, 1.30mm x 1.25mm; Wavelength - Peak: 660nm; Wavelength - Dominant: 645nm; Voltage - Forward (Vf) (Typ): 1.8V; Lens Color: White; Stock 1: 66379; Pricing 1: 1=0.08, 10=0.07, 100=0.0559, 250=0.04892, 500=0.04472 (USD); Packaging: Cut Tape (CT); ComponentLink1URL: http://www.osram-os.com/Graphics/XPic8/00078869_0.pdf; ComponentLink1Description: http://www.osram-os.com/Graphics/XPic8/00078869_0.pdf; Design Item ID: LED_LY974; Source: diode.SchLib; Mounting Type: Surface Mount; Size / Dimension: 2.00mm L x 1.25mm W; Package / Case: 0805 (2012 Metric); RoHS: RoHS Compliant; Color: Red; Supplier Device Package: *; Height (Max): 0.80mm
J3 = CMP-025-0004-1: ULTRAFIT CONN HEADER R/A 2POS 3.5MM; Rule: UNIONINDEX=0|RULEKIND=PolygonConnect|NETSCOPE=AnyNet|LAYERKIND=SameLayer|NAME=Schematic Polygon Connect Style|CONNECTSTYLE=Direct|RELIEFCONDUCTORWIDTH=10mil|RELIEFENTRIES=4|POLYGONRELIEFANGLE=45 Angle|AIRGAPWIDTH=10mil|UNIT=Imperial; Source: connector.SchLib; Design Item ID: MOLEX_1x2_1723101102
Q2 = CMP-078-0020-11: MOSFET N-CH 25V 3.3X3.3 8-SON; Manufacturer: Texas Instruments; Vgs(th) (Max) @ Id: 1.4V @ 250µA; Gate Charge (Qg) @ Vgs: 8.4nC @ 4.5V; FET Type: MOSFET N-Channel, Metal Oxide; Current - Continuous Drain (Id) @ 25°C: 21A (Ta), 60A (Tc); FET Feature: Logic Level Gate; Input Capacitance (Ciss) @ Vds: 1300pF @ 12.5V; Rds On (Max) @ Id, Vgs: 4.5 mOhm @ 24A, 8V; Power - Max: 3W; Supplier Device Package: 8-VSON (3.3x3.3); Mounting Type: Surface Mount; Packaging: Cut Tape (CT); RoHS: RoHS Compliant By Exemption; Pricing 1: 1=1.19, 10=1.061, 100=0.8271, 500=0.68404, 1000=0.43625 (USD); Manufacturer Part Number: CSD16323Q3; Stock 1: 23688; Drain to Source Voltage (Vdss): 25V; Operating Temperature: -55°C ~ 150°C (TJ); ComponentLink1URL: http://www.ti.com/lit/ds/symlink/csd16323q3.pdf; Design Item ID: NFET_CSD16323Q3; Package / Case: 8-PowerTDFN; Source: transistor_fet.SchLib; ComponentLink1Description: http://www.ti.com/lit/ds/symlink/csd16323q3.pdf
R8 = CMP-126-0273-2: as R26 on sheet PressureTransducer; Datasheets: http://www.yageo.com/documents/recent/PYu-RC_Group_51_RoHS_L_9.pdf; Image: //media.digikey.com/Renders/Yageo%20Renders/0603-(1608-Metric).jpg; Tolerance: ±1%; Operating Temperature: -55°C ~ 155°C
R10 = CMP-126-0172-2: RES SMD 1K OHM 1% 1/10W 0603; Manufacturer: Yageo; Manufacturer Part Number: RC0603FR-071KL; Power (Watts): 0.1W, 1/10W; Resistance (Sortable): 1000; Temperature Coefficient: ±100ppm/°C; Image: //media.digikey.com/Renders/Yageo%20Renders/0603-(1608-Metric).jpg; Operating Temperature: -55°C ~ 155°C; Tolerance: ±1%; Datasheets: http://www.yageo.com/documents/recent/PYu-RC_Group_51_RoHS_L_9.pdf
TP29 = CMP-055-0004-2: as TP12-TP21 on sheet AnalogFE; ComponentLink1Description: http://www.keyelco.com/product-pdf.cfm?p=1310; Source: mechanical.SchLib; Part Status: Active; Stock 1: 718799; RoHS: RoHS Compliant; Packaging: Bulk; Mounting Type: 0.040" (1.02mm) Hole Diameter; ComponentLink1URL: http://www.keyelco.com/product-pdf.cfm?p=1310; Pricing 1: 1=0.37, 10=0.316, 50=0.2298, 100=0.2209, 250=0.19832, 500=0.18932, 1000=0.1616, 2500=0.14424, 5000=0.13523 (USD); Size / Dimension: 0.100" Dia x 0.180" L (2.54mm x 4.57mm); Color: Black; Design Item ID: TEST_POINT_BLACK_KEYSTONE_5001

## Nets that join several sheets
5V0: Quail (D1.2), BatteryRegulators (6 pins), MC33797 (C52.1 J2.2 R9.2 U5.10), LevelShifter (C16.1 U6.14)
12V0: BatteryRegulators (7 pins), AnalogFE (FB4.1 FB6.1 FB9.1)
12V0_SW: BatteryRegulators (13 pins), MC33797 (9 pins), SOL1 (D9A.2 J3A.1), SOL2 (D9B.2 J3B.1), SOL3 (D9C.2 J3C.1), SOL4 (D9D.2 J3D.1), SOL5 (D9E.2 J3E.1), SOL6 (D9F.2 J3F.1), SOL7 (D9G.2 J3G.1), SOL8 (D9H.2 J3H.1), SOL9 (D9I.2 J3I.1), SOL10 (D9J.2 J3J.1), SOL11 (D9K.2 J3K.1), SOL12 (D9L.2 J3L.1)
AGND: AnalogFE (29 pins), AFE/LC1 (8 pins), AFE/PT1 (12 pins), AFE/TC1 (5 pins), AFE/TC2 (5 pins), AFE/TC3 (5 pins), AFE/LC2 (8 pins), AFE/PT2 (12 pins), AFE/PT3 (12 pins), AFE/PT4 (12 pins)
AVDD: AnalogFE (11 pins), AFE/LC1 (D26A.3), AFE/PT1 (C39A.1 U12A.4), AFE/TC1 (C43A.1 U13A.7), AFE/TC2 (C43B.1 U13B.7), AFE/TC3 (C43C.1 U13C.7), AFE/LC2 (D26B.3), AFE/PT2 (C39B.1 U12B.4), AFE/PT3 (C39C.1 U12C.4), AFE/PT4 (C39D.1 U12D.4)
DGND: BatteryRegulators (32 pins), MC33797 (12 pins), LevelShifter (C16.2 C17.2 U6.7), Blink_Blink_Beep_Boop (D5.2 D6.2 D7.2 D8.2), SAMD51 (29 pins), SD (C34.1 C35.2 U10.6), Radio (7 pins), AnalogFE (5 pins), Ethernet (16 pins), GPS (8 pins), CAN (C72.1 CANA1.2 J24.3), SOL1 (Q2A.3 R8A.1 R10A.1), SOL2 (Q2B.3 R8B.1 R10B.1), SOL3 (Q2C.3 R8C.1 R10C.1), SOL4 (Q2D.3 R8D.1 R10D.1), SOL5 (Q2E.3 R8E.1 R10E.1), SOL6 (Q2F.3 R8F.1 R10F.1), SOL7 (Q2G.3 R8G.1 R10G.1), SOL8 (Q2H.3 R8H.1 R10H.1), SOL9 (Q2I.3 R8I.1 R10I.1), SOL10 (Q2J.3 R8J.1 R10J.1), SOL11 (Q2K.3 R8K.1 R10K.1), SOL12 (Q2L.3 R8L.1 R10L.1)
IOVDD: BatteryRegulators (FB3.2 TP7.1), LevelShifter (C17.1 U6.1 U6.8), SAMD51 (19 pins), SD (8 pins), Radio (C36.1 C37.1 U11.3 U11.8), AnalogFE (C77.1 C79.1 U15.2), Ethernet (7 pins), GPS (U20.23), CAN (C72.2 CANA1.3 CANA1.5)
V_PT: AnalogFE (C55.1 FB7.2 R71.2 TP13.1), AFE/PT1 (D16A.2 D24A.2 J4A.4 J20A.4), AFE/PT2 (D16B.2 D24B.2 J4B.4 J20B.4), AFE/PT3 (D16C.2 D24C.2 J4C.4 J20C.4), AFE/PT4 (D16D.2 D24D.2 J4D.4 J20D.4)
VBR: AnalogFE (6 pins), AFE/LC1 (C44A.1 D25A.1 J22A.2 U14A.7), AFE/LC2 (C44B.1 D25B.1 J22B.2 U14B.7)
VBUS: Quail (D1.1), SAMD51 (C20.1 J18.1 U8.5)
ADC_CS: SAMD51 (U9.69), AnalogFE (TP18.1 U15.32)
ADC_MICO: SAMD51 (U9.79), AnalogFE (TP19.1 U15.28)
ADC_MOCI: SAMD51 (U9.85), AnalogFE (TP20.1 U15.29)
ADC_SCK: SAMD51 (U9.86), AnalogFE (TP21.1 U15.30)
ADC_SYNC: SAMD51 (U9.87), AnalogFE (TP24.1 U15.27)
AIN1: AnalogFE (U15.5), AFE/PT1 (U12A.1 U12A.2)
AIN2: AnalogFE (U15.6), AFE/PT1 (U12A.5 U12A.7)
AIN3: AnalogFE (U15.7), AFE/PT2 (U12B.1 U12B.2)
AIN4: AnalogFE (U15.8), AFE/PT2 (U12B.5 U12B.7)
AIN5: AnalogFE (U15.9), AFE/PT3 (U12C.1 U12C.2)
AIN6: AnalogFE (U15.10), AFE/PT3 (U12C.5 U12C.7)
AIN7: AnalogFE (U15.11), AFE/PT4 (U12D.1 U12D.2)
AIN8: AnalogFE (U15.14), AFE/PT4 (U12D.5 U12D.7)
AIN12: AnalogFE (U15.18), AFE/LC1 (R49A.1)
AIN13: AnalogFE (U15.19), AFE/LC2 (R49B.1)
BatterySense: BatteryRegulators (D3.2 R2.1 R4.2 TP6.1), SAMD51 (U9.15)
BUSY: SAMD51 (U9.83), Radio (U11.11)
CAN_STBY_1: SAMD51 (U9.68), CAN (CANA1.8)
CurrentSense: BatteryRegulators (R5.2 U1.4), SAMD51 (U9.16)
DIO1: SAMD51 (U9.82), Radio (U11.10)
ETH_CRS_DV: SAMD51 (U9.60), Ethernet (TP25.1 U19.15)
ETH_INT: SAMD51 (U9.96), Ethernet (TP28.1 U19.18)
ETH_MDC: SAMD51 (U9.36), Ethernet (TP22.1 U19.11)
ETH_MDIO: SAMD51 (U9.37), Ethernet (TP23.1 U19.10)
ETH_REF_CLK: SAMD51 (U9.48), Ethernet (U19.16)
ETH_RXD0: SAMD51 (U9.47), Ethernet (U19.13)
ETH_RXD1: SAMD51 (U9.46), Ethernet (U19.12)
ETH_RXER: SAMD51 (U9.49), Ethernet (TP26.1 U19.17)
ETH_TXD0: SAMD51 (U9.54), Ethernet (U19.20)
ETH_TXD1: SAMD51 (U9.55), Ethernet (U19.21)
ETH_TXEN: SAMD51 (U9.53), Ethernet (TP27.1 U19.19)
GPS_PPS: SAMD51 (U9.78), GPS (U20.3)
GPS_RX: SAMD51 (U9.80), GPS (U20.21)
GPS_TX: SAMD51 (U9.81), GPS (U20.20)
LED1: Blink_Blink_Beep_Boop (R19.2), SAMD51 (U9.64)
LED2: Blink_Blink_Beep_Boop (R18.2), SAMD51 (U9.65)
LED3: Blink_Blink_Beep_Boop (R17.2), SAMD51 (U9.66)
LED4: Blink_Blink_Beep_Boop (R16.2), SAMD51 (U9.67)
NetCANA1_1: SAMD51 (U9.35), CAN (CANA1.1)
NetCANA1_4: SAMD51 (U9.34), CAN (CANA1.4)
NetR58_1: AnalogFE (R58.1), AFE/TC1 (U13A.5 U13A.6)
NetR61_1: AnalogFE (R61.1), AFE/TC2 (U13B.5 U13B.6)
NetR64_1: AnalogFE (R64.1), AFE/TC3 (U13C.5 U13C.6)
NetTP1_1: Quail (TP1.1), SAMD51 (U9.23)
NetTP2_1: Quail (TP2.1), SAMD51 (U9.22)
NetTP3_1: Quail (TP3.1), SAMD51 (U9.21)
NetTP30_1: Quail (TP30.1), SAMD51 (U9.10)
NetTP31_1: Quail (TP31.1), SAMD51 (U9.95)
NetTP32_1: Quail (TP32.1), SAMD51 (U9.52)
NetTP33_1: Quail (TP33.1), SAMD51 (U9.61)
NetTP34_1: Quail (TP34.1), SAMD51 (U9.9)
NetTP35_1: Quail (TP35.1), SAMD51 (U9.97)
NetTP36_1: Quail (TP36.1), SAMD51 (U9.98)
NetTP37_1: Quail (TP37.1), SAMD51 (U9.99)
NetTP38_1: Quail (TP38.1), SAMD51 (U9.100)
NetTP39_1: Quail (TP39.1), SAMD51 (U9.8)
NetTP40_1: Quail (TP40.1), SAMD51 (U9.7)
NetTP41_1: Quail (TP41.1), SAMD51 (U9.3)
NetTP42_1: Quail (TP42.1), SAMD51 (U9.4)
NetTP43_1: Quail (TP43.1), SAMD51 (U9.5)
NetU9_70: SAMD51 (U9.70), Radio (U11.13)
NetU9_71: SAMD51 (U9.71), Radio (U11.16)
NetU9_72: SAMD51 (U9.72), Radio (U11.15)
NetU9_73: SAMD51 (U9.73), Radio (U11.14)
NRESET: SAMD51 (U9.84), Radio (U11.12)
PWR_FLT: BatteryRegulators (U4.7), SAMD51 (U9.6)
REF-1V65: AnalogFE (TP16.1 U7.2 U7.6 U15.4), AFE/LC1 (U14A.5), AFE/TC1 (U13A.2), AFE/TC2 (U13B.2), AFE/TC3 (U13C.2), AFE/LC2 (U14B.5)
SD_CLK: SAMD51 (U9.33), SD (U10.5)
SD_CMD: SAMD51 (U9.26), SD (R38.2 U10.3)
SD_DAT0: SAMD51 (U9.27), SD (R39.2 U10.7)
SD_DAT1: SAMD51 (U9.28), SD (R41.2 U10.8)
SD_DAT2: SAMD51 (U9.29), SD (R40.2 U10.1)
SD_DAT3: SAMD51 (U9.32), SD (R37.2 U10.2)
SOL_CTRL: SAMD51 (U9.13), SOL12 (D10L.2 Q2L.2 R8L.2 TP29L.1)
SOL_CTRL: SAMD51 (U9.14), SOL11 (D10K.2 Q2K.2 R8K.2 TP29K.1)
SOL_CTRL: SAMD51 (U9.17), SOL10 (D10J.2 Q2J.2 R8J.2 TP29J.1)
SOL_CTRL: SAMD51 (U9.18), SOL9 (D10I.2 Q2I.2 R8I.2 TP29I.1)
SOL_CTRL: SAMD51 (U9.19), SOL8 (D10H.2 Q2H.2 R8H.2 TP29H.1)
SOL_CTRL: SAMD51 (U9.20), SOL7 (D10G.2 Q2G.2 R8G.2 TP29G.1)
SOL_CTRL: SAMD51 (U9.40), SOL6 (D10F.2 Q2F.2 R8F.2 TP29F.1)
SOL_CTRL: SAMD51 (U9.41), SOL5 (D10E.2 Q2E.2 R8E.2 TP29E.1)
SOL_CTRL: SAMD51 (U9.42), SOL4 (D10D.2 Q2D.2 R8D.2 TP29D.1)
SOL_CTRL: SAMD51 (U9.43), SOL3 (D10C.2 Q2C.2 R8C.2 TP29C.1)
SOL_CTRL: SAMD51 (U9.44), SOL2 (D10B.2 Q2B.2 R8B.2 TP29B.1)
SOL_CTRL: SAMD51 (U9.45), SOL1 (D10A.2 Q2A.2 R8A.2 TP29A.1)
SQB_CS: LevelShifter (U6.2), SAMD51 (U9.58)
SQB_MICO: LevelShifter (U6.5), SAMD51 (U9.59)
SQB_MOCI: LevelShifter (U6.3), SAMD51 (U9.57)
SQB_SCK: LevelShifter (U6.4), SAMD51 (U9.56)
SQUIB_CS: MC33797 (TP11.1 U5.30), LevelShifter (U6.13)
Squib_MICO: MC33797 (TP10.1 U5.9), LevelShifter (U6.10)
Squib_MOCI: MC33797 (TP8.1 U5.3), LevelShifter (U6.12)
Squib_SCK: MC33797 (TP9.1 U5.4), LevelShifter (U6.11)

## Assembly variants
Quail_3.1_Rev1: not fitted C72 CANA1 H1 H2 H3 H4 H5 H6 H7 H8 J2 J24 R90 TP1 TP2 TP3 TP4 TP5 TP6 TP7 TP8 TP9 TP10 TP11 TP12 TP13 TP14 TP15 TP16 TP17 TP18 TP19 TP20 TP21 TP22 TP23 TP24 TP25 TP26 TP27 TP28 TP29A TP29B TP29C TP29D TP29E TP29F TP29G TP29H TP29I TP29J TP29K TP29L TP30 TP31 TP32 TP33 TP34 TP35 TP36 TP37 TP38 TP39 TP40 TP41 TP42 TP43 U20; alternate parts R29A -> CMP-00033-1, R29B -> CMP-00033-1, C69 -> CMP-119-0071-1, C45A -> CMP-119-0065-1, C45B -> CMP-119-0065-1, C47B -> CMP-119-0065-1, C47A -> CMP-119-0065-1